# EAGLE design ACS_5.X_Breadboard_Prototype (EAGLE 9.6.2)
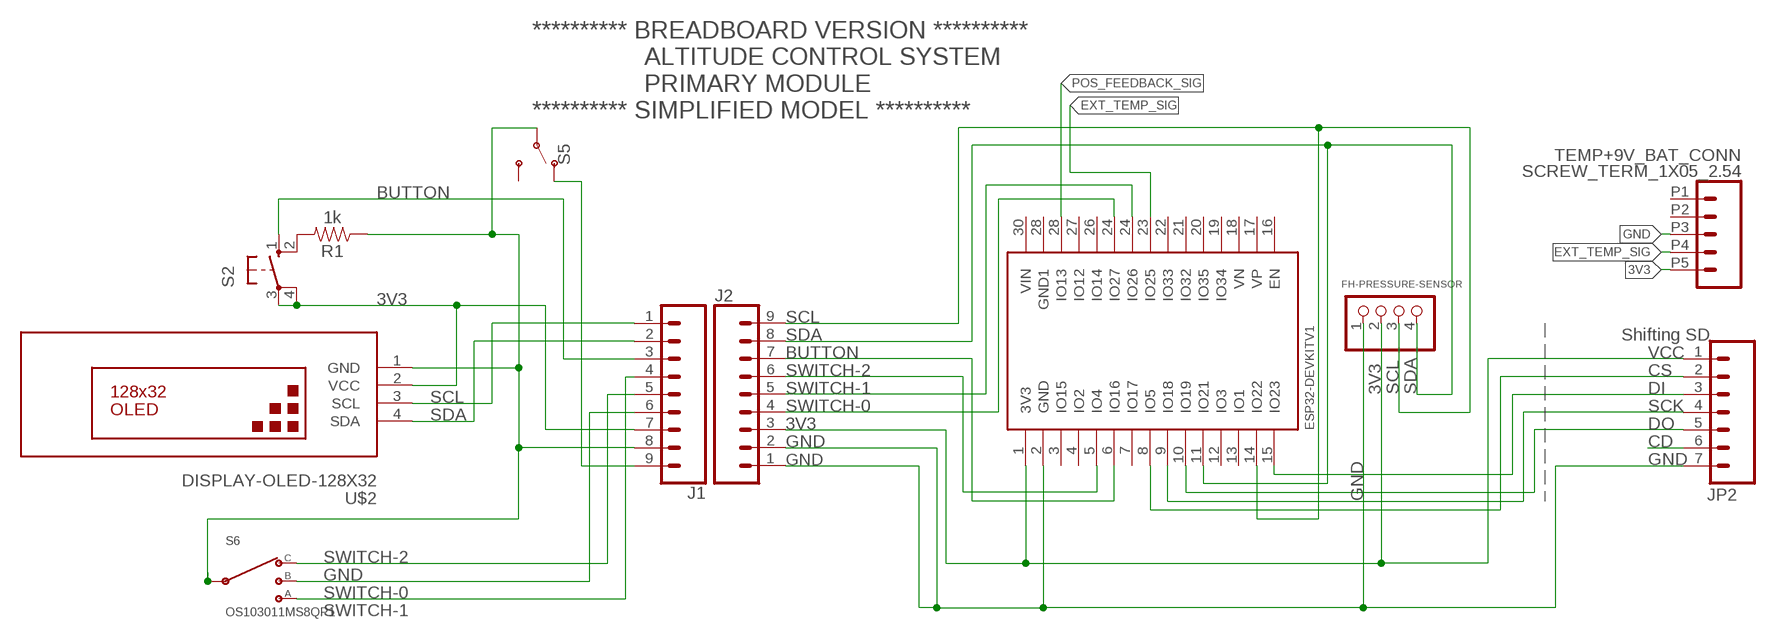
[diagram p0: schematic, sheet 1]

## Parts
FH-PRESSURE-SENSOR  PINHD-1X4  [1X04]
J1  CONN_09  [1X09]
J2  CONN_09  [1X09]
JP2  M07  [1X07]
R1  1k  1KOHM-HORIZ-1/4W-1%  [AXIAL-0.3]
S2  10-XX  [B3F-10XX]
S5  SWITCH-SPDT-PTH-11.6X4.0MM  [SWITCH_SPDT_PTH_11.6X4.0MM]
S6  OS103011MS8QP1  [OS102011MS8QP1]
TEMP+9V_BAT_CONN  SCREW_TERM_1X05_2.54  [1X05_2.54_SCREWTERM]
U$2  DISPLAY-OLED-128X32  [DISPLAY-OLED-128X32]
U$3  ESP32DEVKITV1  [ESP32-DEVKITV1]

## Nets
3V3: FH-PRESSURE-SENSOR.2 J1.7 J2.3 JP2.1 S2.3(P) S2.4(P1) TEMP+9V_BAT_CONN.P5 U$2.2(VCC) U$3.1(3V3)
BUTTON: J1.3 J2.7 S2.1(S) U$3.6(IO16)
EXT_TEMP_SIG: TEMP+9V_BAT_CONN.P4 U$3.23(IO25)
GND: FH-PRESSURE-SENSOR.1 J1.8 J2.1 J2.2 JP2.7 R1.P$1 S5.2(P) S6.2(C) TEMP+9V_BAT_CONN.P3 U$2.1(GND) U$3.2(GND)
N$1: R1.P$2 S2.2(S1)
N$4: J1.9 S5.1(O)
N$8: JP2.6
N$11: JP2.3 U$3.15(IO23)
N$12: JP2.2 U$3.8(IO5)
N$13: JP2.4 U$3.9(IO18)
N$14: JP2.5 U$3.10(IO19)
POS_FEEDBACK_SIG: U$3.28(IO13)
SCL: FH-PRESSURE-SENSOR.3 J1.1 J2.9 U$2.3(SCL) U$3.14(IO22)
SDA: FH-PRESSURE-SENSOR.4 J1.2 J2.8 U$2.4(SDA) U$3.11(IO21)
SWITCH-0: J1.6 J2.4 S6.3 U$3.24(IO27)
SWITCH-1: J1.5 J2.5 S6.4 U$3.24(IO26)
SWITCH-2: J1.4 J2.6 S6.1 U$3.5(IO4)
Unconnected: S5.3(S) TEMP+9V_BAT_CONN.P1 TEMP+9V_BAT_CONN.P2 U$3.3(IO15) U$3.4(IO2) U$3.7(IO17) U$3.12(IO3) U$3.13(IO1) U$3.16(EN) U$3.17(VP) U$3.18(VN) U$3.19(IO34) U$3.20(IO35) U$3.21(IO32) U$3.22(IO33) U$3.26(IO14) U$3.27(IO12) U$3.28(GND1) U$3.30(VIN)

## Notes on the sheet
- ********** BREADBOARD VERSION ********** 
                  ALTITUDE CONTROL SYSTEM
                  PRIMARY MODULE
  ********** SIMPLIFIED MODEL **********
- Shifting SD
- VCC
- CS
- DI
- SCK
- DO
- CD

## Library data of the parts
FH-PRESSURE-SENSOR = pinhead:PINHD-1X4: PIN HEADER
J1 J2 = SparkFun-Connectors:CONN_09: Multi connection point. Often used as Generic Header-pin footprint for 0.1 inch spaced/style header connections On any of the 0.1 inch spaced packages, you can populate with these: Break Away Headers - Straight <https://www.sparkfun.com/products/116> (PRT-00116) Break Away Male Headers - Right Angle <https://www.sparkfun.com/products/553> (PRT-00553) Female Headers <https://www.sparkfun.com/products/115> (PRT-00115) Break Away Headers - Machine Pin <https://www.sparkfun.com/products/117> (PRT-00117) Break Away Female Headers - Swiss Machine Pin <https://www.sparkfun.com/products/743> (PRT-00743) For SCREWTERMINALS and SPRING TERMINALS visit here: Screw Terimnals on SparkFun.com <https://www.sparkfun.com/search/results?term=Screw+Terminals> (5mm/3.5mm/2.54mm spacing) This device is also useful as a general connection point to wire up your design to another part of your project. Our various solder wires solder well into these plated through hole pads. Hook-Up Wire - Assortment (Stranded, 22 AWG) <https://www.sparkfun.com/products/11375> (PRT-11375) Hook-Up Wire - Assortment (Solid Core, 22 AWG) <https://www.sparkfun.com/products/11367> (PRT-11367) View the entire wire category on our website here <https://www.sparkfun.com/categories/141> Special notes: Molex polarized connector foot print use with SKU : PRT-08231 with associated crimp pins and housings. 1MM SMD Version SKU: PRT-10208 NOTES ON THE VARIANTS LOCK and LOCK_LONGPADS... This footprint was designed to help hold the alignment of a through-hole component (i.e. 6-pin header) while soldering it into place. You may notice that each hole has been shifted either up or down by 0.005 of an inch from it's more standard position (which is a perfectly straight line). This slight alteration caused the pins (the squares in the middle) to touch the edges of the holes. Because they are alternating, it causes a "brace" to hold the component in place. 0.005 has proven to be the perfect amount of "off-center" position when using our standard breakaway headers. Although looks a little odd when you look at the bare footprint, once you have a header in there, the alteration is very hard to notice. Also,if you push a header all the way into place, it is covered up entirely on the bottom side.
JP2 = SparkFun-Connectors:M07: Header 7 Standard 7-pin 0.1" header. Use with straight break away headers (SKU : PRT-00116), right angle break away headers (PRT-00553), swiss pins (PRT-00743), machine pins (PRT-00117), and female headers (PRT-00115). NOTES ON THE VARIANTS LOCK and LOCK_LONGPADS... This footprint was designed to help hold the alignment of a through-hole component (i.e. 7-pin header) while soldering it into place. You may notice that each hole has been shifted either up or down by 0.005 of an inch from it's more standard position (which is usually a perfectly straight line). This slight alteration caused the pins (the squares in the middle) to touch the edges of the holes. Because they are alternating, it causes a "brace" to hold the header in place. 0.005 has proven to be the perfect amount of "off-center" position when using our standard breakaway headers. Although looks a little odd when you look at the bare footprint, once you have a header in there, the alteration is very hard to notice. Also, if you push a header all the way into place, it is covered up entirely on the bottom side. This idea of altering the position of holes to aid alignment will be further integrated into the Sparkfun Library for other footprints. It can help hold any component with 3 or more connection pins.
R1 = SparkFun-Resistors:1KOHM: 1kΩ resistor A resistor is a passive two-terminal electrical component that implements electrical resistance as a circuit element. Resistors act to reduce current flow, and, at the same time, act to lower voltage levels within circuits. - Wikipedia; PROD_ID: RES-12182
S2 = DC_LOAD_AU:10-XX: OMRON SWITCH; MPN: B3F-1000; OC_FARNELL: 176432; OC_NEWARK: 36M3542
S5 = SparkFun-Switches:SWITCH-SPDT: Single Pole, Double Throw (SPDT) Switch Single-pole, double-throw (SPDT) switch. Variant Overview SMD-AYZ0202 Surface Mount DPDT Switch <https://www.sparkfun.com/products/597> (COM-00597) Used on e.g. LilyPad Arduino USB - ATmega32U4 Board <https://www.sparkfun.com/products/12049> PTH-11.6X4.0MM SPDT Mini Power Switch <https://www.sparkfun.com/products/102> (COM-00102) Used on e.g. SparkFun Simon Says - Through-Hole Soldering Kit <https://www.sparkfun.com/products/10547> (KIT-10547) PTH-11.6X4.0MM-KIT KIT version of SPDT Mini Power Switch - Simplifies soldering by removing tStop of switch pins - only one side can be soldered. PTH-11.6X4.0MM-LOCK LOCK version of SPDT Mini Power Switch - Offset pins hold switch in place for easier soldering. SMD-RIGHT-ANGLE Surface Mount Right Angle Switch <https://www.sparkfun.com/products/10860> (COM-10860) Used on e.g. SparkFun ESP8266 Thing <https://www.sparkfun.com/products/13231>; PROD_ID: SWCH-08261; SF_SKU: COM-00102
S6 = OS103011MS8QP1:OS103011MS8QP1: Slide Switch SP3T Through Hole; AVAILABILITY: Unavailable; DESCRIPTION: Switch Slide ON ON ON SP3T Top Slide 0.1A 12VDC 10000Cycle PC Pins Bracket Mount/Through Hole Bulk; MF: C&K; MP: OS103011MS8QP1; PACKAGE: None; PRICE: None
TEMP+9V_BAT_CONN = Connectors-Terminal_Block:SCREW_TERM_1X05_2.54
U$2 = diy-modules:DISPLAY-OLED-128X32: 128x32 Dot Matrix OLED Module with I2C interface based on SSD1306 chip More details available here: http://www.tinyosshop.com/index.php?route=product/product&product_id=953 Schematic available here: http://www.tinyosshop.com/datasheet/OLED%2012832.pdf SSD1306 datasheet: https://cdn-shop.adafruit.com/datasheets/SSD1306.pdf Click here to find device on ebay.com <http://www.ebay.com/sch/oled+display+128x32+i2c>
U$3 = ESP32-DEVKITV1:ESP32DEVKITV1

## Board
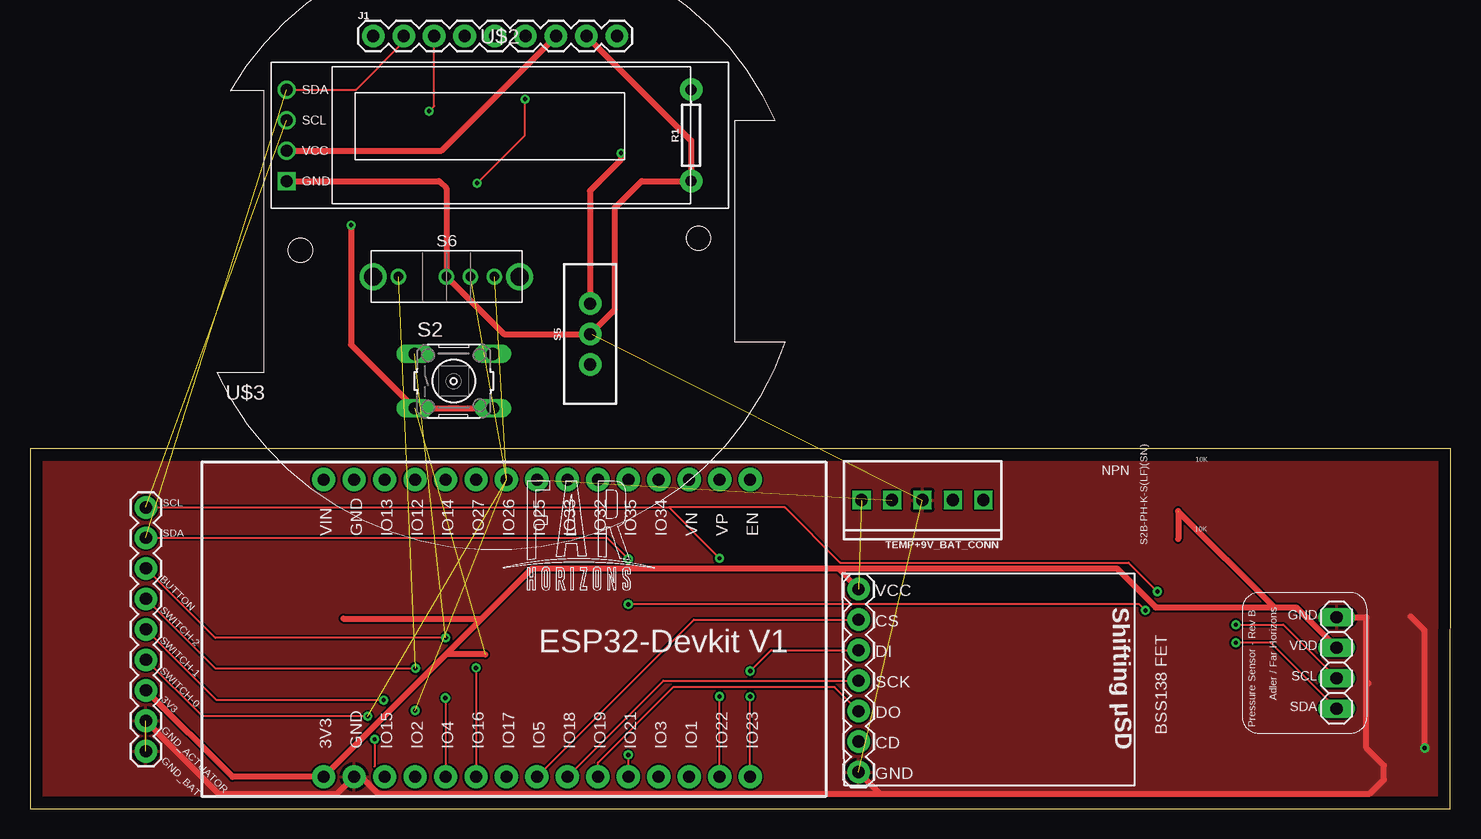
[diagram p1: board, top side]
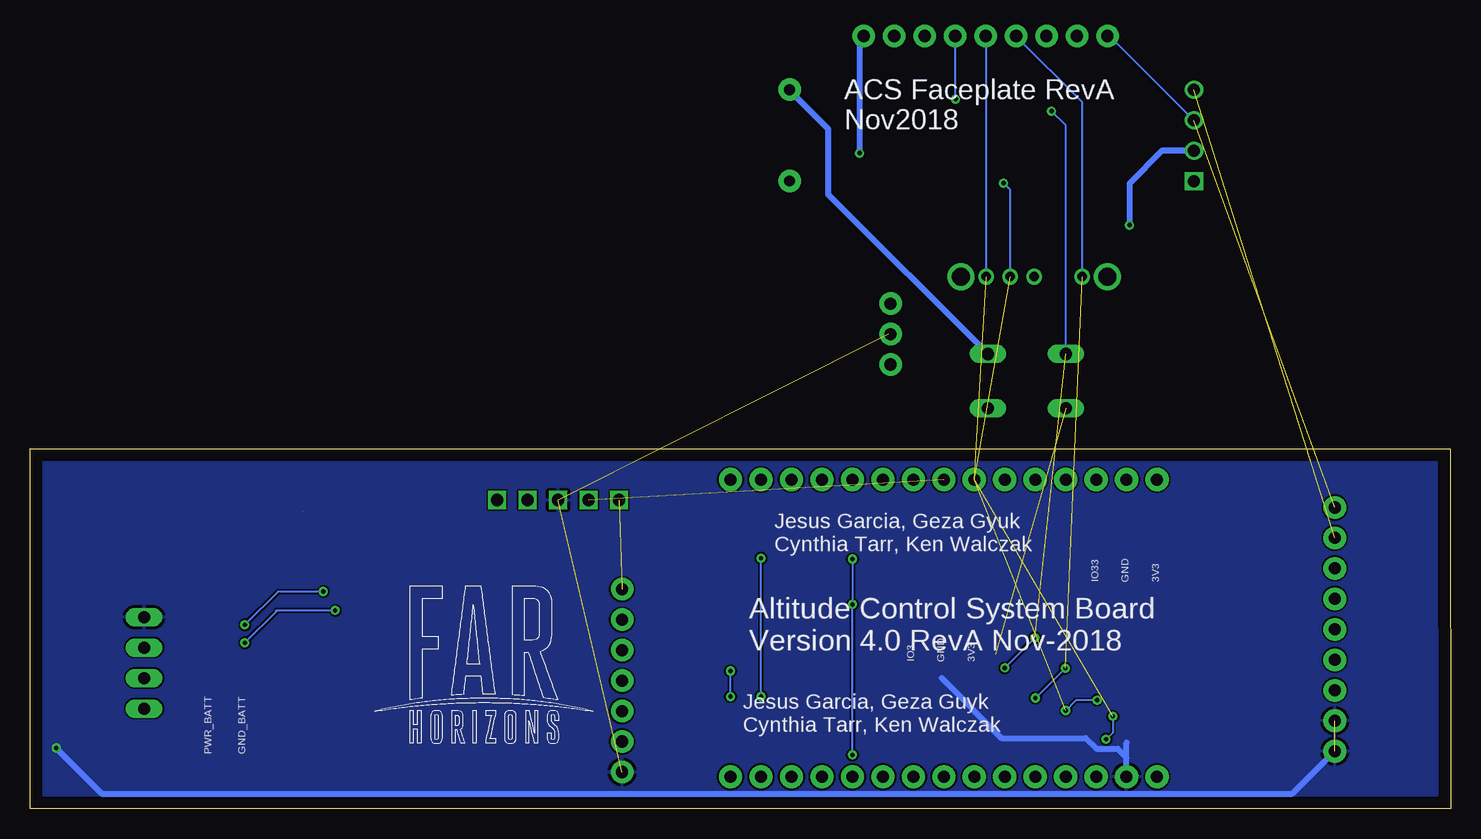
[diagram p2: board, bottom side, seen from below]

Size 118.43 x 30 mm. Coordinates in mm from the lower left corner, seen from the top.
Outline: 0,0 118.4,0 118.43,30 0.03,30 0,0
Copper layers (1*16): Top 0.035mm / dielectric 1.5mm / Bottom 0.035mm
Design rules "default": minimum track width 6mil, minimum drill 0.35mm, track to track 6mil, track to pad 6mil, pad to pad 6mil, via to via 6mil, smd to smd 6mil, copper to edge 40mil, drill to drill 6mil, minimum pad ring 10mil, minimum via ring 8mil, stop-mask expansion 4mil, vias tented up to drill 0mil, thermal gap 10mil

### Footprints (pad centres in the part's own frame; a part is rotated, then mirrored left to right if it is on the bottom)
1X04 = drill 1.016 long: 1 -3.81,0; 2 -1.27,0; 3 1.27,0; 4 3.81,0
1X09 = drill 1.016 pad 1.88: 1 0,0; 2 2.54,0; 3 5.08,0; 4 7.62,0; 5 10.16,0; 6 12.7,0; 7 15.24,0; 8 17.78,0; 9 20.32,0
1X07 = drill 1.016 pad 1.88: 1 0,0; 2 2.54,0; 3 5.08,0; 4 7.62,0; 5 10.16,0; 6 12.7,0; 7 15.24,0
AXIAL-0.3 = drill 0.9 pad 1.88: P$1 -3.81,0; P$2 3.81,0
B3F-10XX = drill 1.016 long: 1 -3.251,2.261; 2 3.251,2.261; 3 -3.251,-2.261; 4 3.251,-2.261
SWITCH_SPDT_PTH_11.6X4.0MM = drill 1.016 pad 1.88: 1 0,2.54; 2 0,0; 3 0,-2.54
OS102011MS8QP1 = drill 0.8: 1 -4,0; 2 0,0; 3 2,0; 4 4,0 | drill 1.5: MOUNT1 -6.1,0; MOUNT2 6.1,0
1X05_2.54_SCREWTERM = drill 1.016 square: P1 0,0; P2 2.54,0; P3 5.08,0; P4 7.62,0; P5 10.16,0
DISPLAY-OLED-128X32 = drill 1 square: 1 -17.78,-3.81 | drill 1: 2 -17.78,-1.27; 3 -17.78,1.27; 4 -17.78,3.81
ESP32-DEVKITV1 = drill 1 pad 1.93: 1 -22.87,-13.54; 2 -20.33,-13.54; 3 -17.79,-13.54; 4 -15.25,-13.54; 5 -12.71,-13.54; 6 -10.17,-13.54; 7 -7.63,-13.54; 8 -5.09,-13.54; 9 -2.55,-13.54; 10 -0.01,-13.54; 11 2.53,-13.54; 12 5.07,-13.54; 13 7.61,-13.54; 14 10.15,-13.54; 15 12.69,-13.54; 16 12.69,11.23; 17 10.15,11.23; 18 7.61,11.23; 19 5.07,11.23; 20 2.53,11.23; 21 -0.01,11.23; 22 -2.55,11.23; 23 -5.09,11.23; 24 -7.63,11.23; 25 -10.17,11.23; 26 -12.71,11.23; 27 -15.25,11.23; 28 -17.79,11.23; 29 -20.33,11.23; 30 -22.87,11.23

### Placement (x,y rotation side)
FH-PRESSURE-SENSOR  108.92,12.15 270 top
J1  28.61,64.39 0 top  (outside the outline)
J2  9.66,4.79 90 top
JP2  69.07,18.3 270 top
R1  55.11,56.12 90 top  (outside the outline)
S2  35.33,35.64 0 top  (outside the outline)
S5  46.7,39.56 0 top  (outside the outline)
S6  34.72,44.34 0 top  (outside the outline)
TEMP+9V_BAT_CONN  79.48,25.73 180 top
U$2  39.17,56.12 0 top  (outside the outline)
U$3  47.34,16.2 0 top

### Tracks (layer width: path | path; a pad name or v marks a point on that pad's centre or on a via)
3V3  (via drill 0.35)  (3 unrouted)
  Top 0.508: J2.3 16.88,2.65 U$3.1 34.67,12.86 | 34.67,12.86 37.66,15.85 | 37.66,15.85 41.84,20.03 67.34,20.03 | JP2.1 67.34,20.03 | 67.34,20.03 90.6,20.03 93.84,16.79 93.84,16.78 103.72,16.78 | 103.72,16.78 105.56,16.78 FH-PRESSURE-SENSOR.2 | 95.71,24.78 95.71,22.49 | 26.11,15.85 37.66,15.85 | 37.94,12.86 34.67,12.86 | 103.72,16.78 95.7,24.81 | U$2.2 34.31,54.85 J1.7 | v26.77,48.64 26.77,38.69 S2.3 S2.4
  Bottom 0.508: U$2.2 24.07,54.84 26.77,52.09 v26.77,48.64
BUTTON  (via drill 0.35)  (1 unrouted)
  Top 0.152: v37.17,11.74 U$3.6 | v34.66,14.25 15.44,14.25 J2.7 | v33.27,58.14 33.69,58.56 J1.3
  Bottom 0.152: v34.66,14.25 v37.17,11.74 | v33.27,58.14 32.08,56.95 S2.1
EXT_TEMP_SIG  (1 unrouted)
GND  (via drill 0.35)  (3 unrouted)
  Top 0.152: S5.2 46.82,39.56 46.85,39.56
  Top 0.508: J2.2 15.73,1.27 25.62,1.27 U$3.2 27.61,2.67 29.01,1.27 70.86,1.27 | 70.86,1.27 111.7,1.27 112.86,2.43 112.86,3.6 111.4,5.06 111.4,10.61 | JP2.7 70.86,1.27 | 111.56,10.45 111.4,10.61 | 111.4,10.61 111.4,15.95 111.39,15.96 FH-PRESSURE-SENSOR.1 | 115.07,16.04 116.25,14.86 v116.25,5.07 v116.25,5.06 | J1.8 55.11,55.67 R1.P$1 50.99,52.31 48.77,50.09 48.77,41.63 S5.2 | 46.82,39.56 39.5,39.56 S6.2 34.72,51.69 34.1,52.31 U$2.1
  Bottom 0.508: U$3.2 27.02,4.25 | 27.02,4.25 27.02,5.51 27,5.53 | 42.44,10.9 37.43,5.9 30.44,5.9 29.55,5.01 27.77,5.01 27.02,4.25 | v116.25,5.06 112.46,1.27 13.18,1.27 J2.1
  pour Top: -4.15,31.64 -4.15,-1.81 119.4,-1.81 119.4,31.64
  pour Bottom: -5.76,31.6 -5.76,-1.75 119.61,-1.75 119.61,31.6
N$1
  Bottom 0.508: S2.2 51.87,51.19 51.87,56.64 55.11,59.88 R1.P$2
N$4  (via drill 0.35)
  Top 0.508: v49.27,54.64 49.27,54.09 46.67,51.49 46.67,42.13 S5.1
  Bottom 0.508: J1.9 49.27,64.05 v49.27,54.64
N$11  (via drill 0.35)
  Top 0.152: U$3.15 v60.03,9.35 | v60.03,11.48 61.77,13.22 JP2.3
  Bottom 0.152: v60.03,9.35 v60.03,11.48
N$12
  Top 0.152: U$3.8 55.35,15.76 JP2.2
N$13
  Top 0.152: U$3.9 52.81,10.68 JP2.4
N$14
  Top 0.152: U$3.10 47.34,3.85 53.61,10.13 67.08,10.13 JP2.5
SCL  (via drill 0.35)  (1 unrouted)
  Top 0.152: U$3.14 v57.49,9.35 v57.49,9.36 | J2.9 53.25,25.11 | 53.25,25.11 v57.49,20.88 | v93.98,18.11 91.56,20.52 67.53,20.52 62.94,25.11 53.25,25.11 | v100.52,15.34 104.46,15.34 FH-PRESSURE-SENSOR.3
  Bottom 0.152: v93.98,18.11 97.75,18.11 v100.52,15.34 | v57.49,9.36 v57.49,20.88 | U$2.3 28.39,64.39 J1.1
SDA  (via drill 0.35)  (1 unrouted)
  Top 0.152: J2.8 48.12,22.57 | v92.98,16.53 92.48,17.03 v49.88,17.03 | FH-PRESSURE-SENSOR.4 103.43,13.83 v100.52,13.83 | v49.88,20.82 48.12,22.57 | 48.12,22.57 | U$3.11 v49.88,4.49 | U$2.4 27.17,59.93 31.15,63.91 J1.2
  Bottom 0.152: v100.52,13.83 97.91,16.44 97.91,16.53 v92.99,16.53 v92.98,16.53 | v49.88,20.82 v49.88,17.03 v49.88,4.49
SWITCH-0  (via drill 0.35)  (2 unrouted)
  Top 0.152: v28.16,7.7 14.38,7.7 J2.4 | v28.73,5.8 28.71,5.79 28.71,3.5 | v37.27,52.14 41.27,56.14 v41.27,59.14
  Bottom 0.152: v28.73,5.8 28.18,6.34 28.18,7.68 v28.16,7.7 | 36.87,51.74 v37.27,52.14 36.72,51.59 S6.3 | v41.27,59.14 41.27,64.35 J1.6
SWITCH-1  (via drill 0.35)  (2 unrouted)
  Top 0.152: v29.47,9.06 15.55,9.06 J2.5
  Bottom 0.152: v29.47,9.06 31.23,9.06 v32.09,8.19 | 38.87,64.29 J1.5 38.72,64.34 S6.4
SWITCH-2  (via drill 0.35)  (1 unrouted)
  Top 0.152: v34.62,9.23 34.62,2.67 U$3.5 | J2.6 15.43,11.72 v32.13,11.72
  Bottom 0.152: v34.62,9.23 v32.13,11.72 | J1.4 30.72,58.88 S6.1

### Text on the board
tPlace: Shifting µSD
bPlace: ACS Faceplate RevA / Nov2018 | Jesus Garcia, Geza Gyuk / Cynthia Tarr, Ken Walczak | Altitude Control System Board / Version 4.0 RevA Nov-2018 | Jesus Garcia, Geza Guyk / Cynthia Tarr, Ken Walczak
tNames: 10K | NPN | SCL | SDA | 10K | S2B-PH-K-S(LF)(SN) | BUTTON | VCC | SWITCH-2 | Pressure Sensor - Rev B | Adler / Far Horizons | GND | CS | SWITCH-1 | VDD | DI | SWITCH-0 | SCL | SCK | 3V3 | SDA | DO | GND_ACTUATOR | BSS138 FET | CD | GND_BAT | GND
bNames: GND | IO33 | 3V3 | 3V3 | GND | IO3 | GND_BATT | PWR_BATT
tValues: 10uF | 0.33uF
Measures: center: 19.59
Document: Measurements of: / - OLED 38.11 x 12 mm / - Switch (3) 17 x 6 mm OS103011MS8QP1 / - Switch (2) 3.8 x 8.6 mm / - Button 6.15 x 6.15 mm / - Size of Screw Hole / - 3mm floors / / Location of Hole(s) made with Vias / Dimension Constraints 50mm diameter / Location of Part Placement / Abs Center to 9pin connector: 17.25